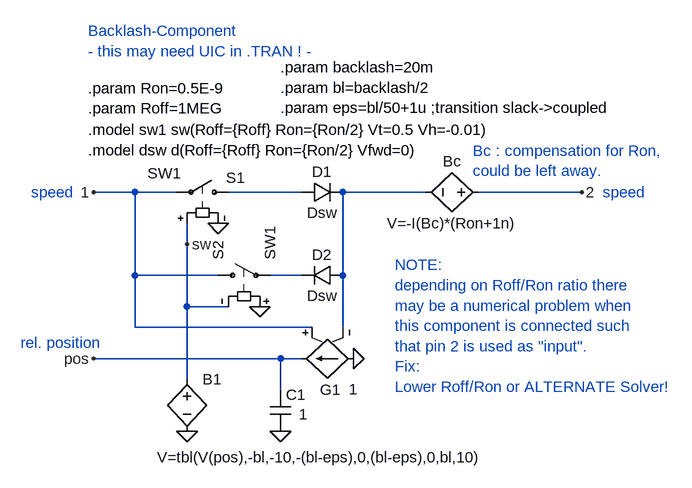
[diagram p0: schematic backlash.asc]
backlash.asc, the LTspice schematic file:
Version 4
SHEET 1 1276 924
WIRE -160 -16 -224 -16
WIRE -160 112 -160 -16
WIRE -160 192 -160 112
WIRE -96 -16 -160 -16
WIRE -80 64 -80 32
WIRE -80 160 -80 64
WIRE -80 272 -80 160
WIRE -32 112 -160 112
WIRE -16 160 -80 160
WIRE 64 240 -224 240
WIRE 64 288 64 240
WIRE 96 -16 -16 -16
WIRE 96 112 48 112
WIRE 96 240 64 240
WIRE 112 192 -160 192
WIRE 160 112 160 -16
WIRE 160 192 160 112
WIRE 288 -16 160 -16
WIRE 528 -16 368 -16
FLAG 176 240 0
FLAG 64 352 0
FLAG 528 -16 2
FLAG -224 240 pos
FLAG -224 -16 1
FLAG -80 64 sw
FLAG -80 352 0
FLAG -32 32 0
FLAG 32 160 0
SYMBOL g 80 240 M90
WINDOW 0 48 77 VLeft 0
WINDOW 3 47 103 VLeft 0
SYMATTR InstName G1
SYMATTR Value 1
SYMBOL cap 48 288 R0
WINDOW 3 44 38 Left 0
SYMATTR Value 1
SYMATTR InstName C1
SYMBOL sw 0 -16 M270
WINDOW 0 22 20 VLeft 0
WINDOW 3 29 141 VLeft 0
SYMATTR InstName S1
SYMATTR Value SW1
SYMBOL bv -80 256 R0
WINDOW 3 -46 136 Left 0
SYMATTR Value V=tbl(V(pos),-bl,-10,-(bl-eps),0,(bl-eps),0,bl,10)
SYMATTR InstName B1
SYMBOL diode 96 0 R270
WINDOW 0 32 32 VTop 0
WINDOW 3 0 32 VBottom 0
SYMATTR InstName D1
SYMATTR Value Dsw
SYMBOL sw -48 112 R270
SYMATTR InstName S2
SYMATTR Value SW1
SYMBOL diode 160 96 R90
WINDOW 0 0 32 VBottom 0
WINDOW 3 32 32 VTop 0
SYMATTR InstName D2
SYMATTR Value Dsw
SYMBOL bv 384 -16 R90
WINDOW 0 -32 56 VBottom 0
WINDOW 3 32 56 VTop 0
SYMATTR InstName Bc
SYMATTR Value V=-I(Bc)*(Ron+1n)
TEXT -232 -112 Left 0 !.model sw1 sw(Roff={Roff} Ron={Ron/2} Vt=0.5 Vh=-0.01)\n.model dsw d(Roff={Roff} Ron={Ron/2} Vfwd=0)
TEXT 64 -208 Left 0 !.param backlash=20m\n.param bl=backlash/2\n.param eps=bl/50+1u ;transition slack->coupled
TEXT -232 -264 Left 0 ;Backlash-Component\n- this may need UIC in .TRAN ! -
TEXT -336 216 Left 0 ;rel. position
TEXT 560 -16 Left 0 ;speed
TEXT -320 -16 Left 0 ;speed
TEXT -232 -176 Left 0 !.param Ron=0.5E-9\n.param Roff=1MEG
TEXT 240 96 Left 0 ;NOTE:\ndepending on Roff/Ron ratio there\nmay be a numerical problem when\nthis component is connected such\nthat pin 2 is used as "input".\nFix:\nLower Roff/Ron or ALTERNATE Solver!
TEXT 360 -80 Left 0 ;Bc : compensation for Ron,\ncould be left away.

The netlist it stands for:
* backlash.asc
G1 0 pos 1 N003 1
C1 pos 0 1
S1 N001 1 sw 0 SW1
B1 sw 0 V=tbl(V(pos),-bl,-10,-(bl-eps),0,(bl-eps),0,bl,10)
D1 N001 N003 Dsw
S2 1 N002 0 sw SW1
D2 N003 N002 Dsw
Bc 2 N003 V=-I(Bc)*(Ron+1n)
.model D D
.lib standard.dio
.model sw1 sw(Roff={Roff} Ron={Ron/2} Vt=0.5 Vh=-0.01)
.model dsw d(Roff={Roff} Ron={Ron/2} Vfwd=0)
.param backlash=20m
.param bl=backlash/2
.param eps=bl/50+1u ;transition slack->coupled
* Backlash-Component
* - this may need UIC in .TRAN ! -
* rel. position
* speed
* speed
.param Ron=0.5E-9
.param Roff=1MEG
* NOTE:
* depending on Roff/Ron ratio there
* may be a numerical problem when
* this component is connected such
* that pin 2 is used as "input".
* Fix:
* Lower Roff/Ron or ALTERNATE Solver!
* Bc : compensation for Ron,
* could be left away.
.backanno
.end